# Altium schematic sheet ultrasonic_tank_monitor_battery.SchDoc
size A4; SheetNumber: 3; SheetTotal: 3
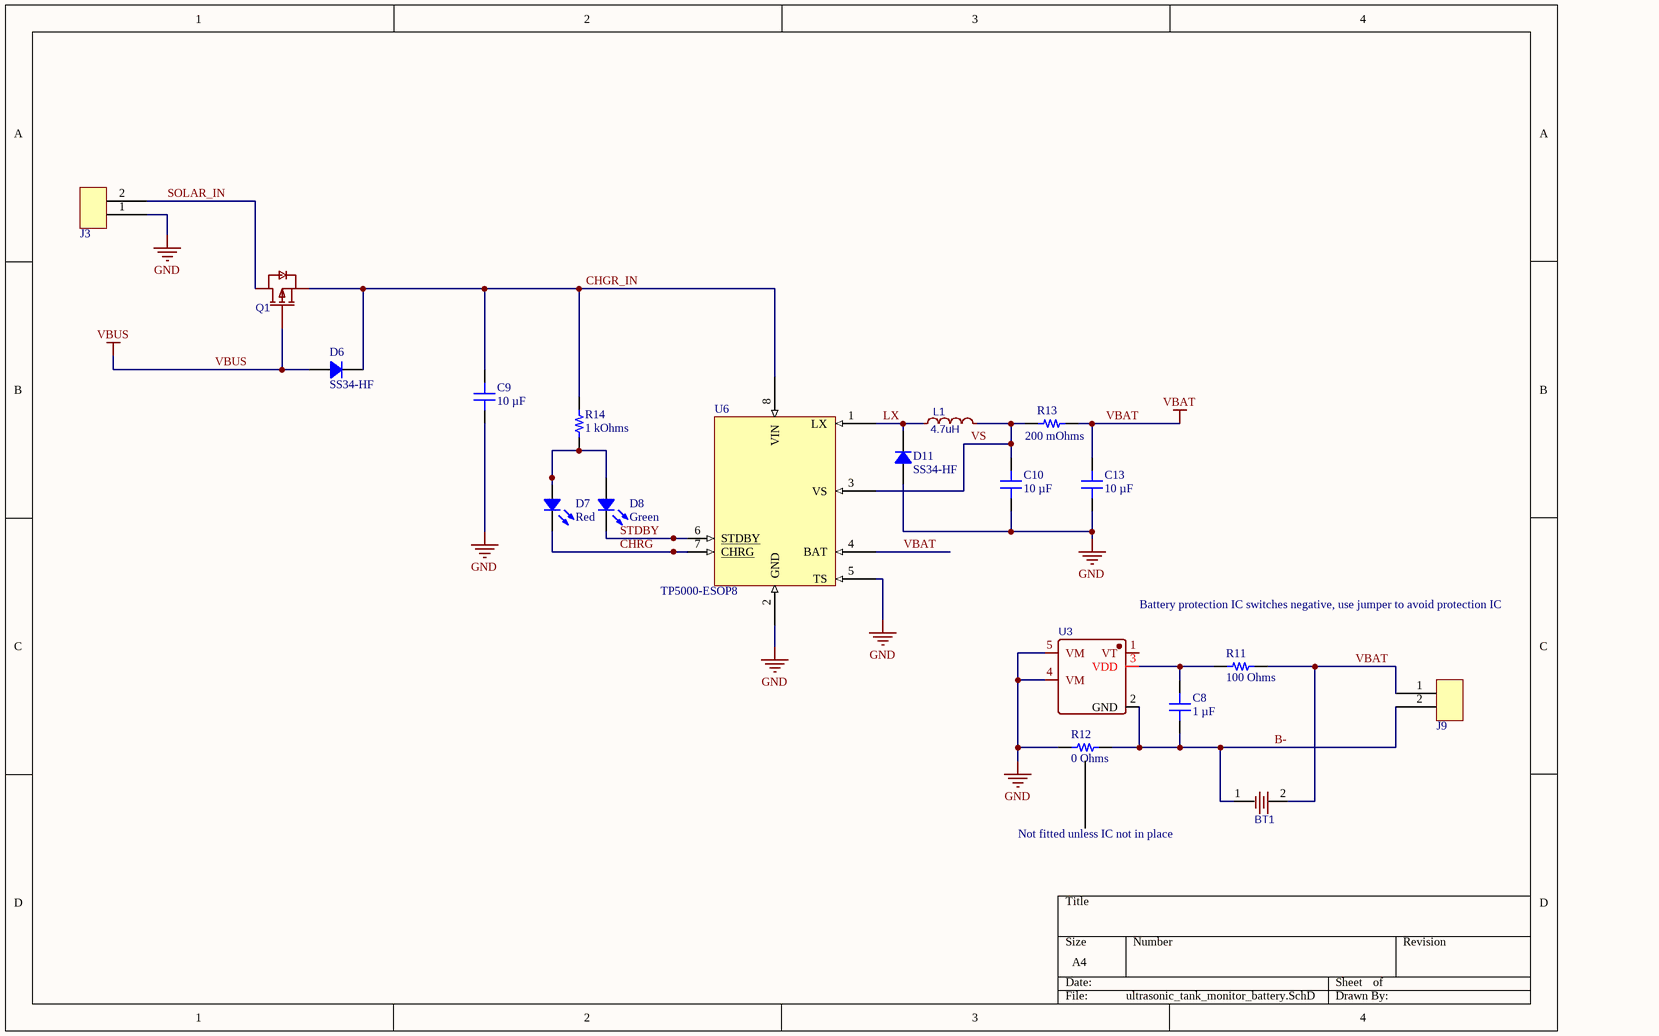
[diagram p0: ultrasonic_tank_monitor_battery.SchDoc]

## Parts
BT1  BH-18650-B1BA002  [BATTERY-SMD_18650-1S-L77.1-W20.7-1]  (value not drawn)
C8  1 µF  [CAP 0603_1608]
C9  10 µF  [CAP 0603_1608]
C10  10 µF  [CAP 0603_1608]
C13  10 µF  [CAP 0603_1608]
D6  SS34-HF  [DO214AC SMA]
D7  Red  [LED 0805_2012 RED]
D8  Green  [LED 0805_2012 GREEN]
D11  SS34-HF  [DO214AC SMA]
J3  B2B-PH-K-S  [CONN-TH_B2B-PH-K-S]  (value not drawn)
J9  S2B-PH-K-S  [CONN-TH_S2B-PH-K-S-LF-SN]  (value not drawn)
L1  4.7uH  [IND-SMD_L5.2-W5.2_YSPI0530]
Q1  SI2301-ZE  [SOT-23-3_L2.9-W1.3-P1.90-LS2.4-BR]  (value not drawn)
R11  100 Ohms  [RES 0603_1608]
R12  0 Ohms  [RES 1206_3216]
R13  200 mOhms  [RES 1206_3216]
R14  1 kOhms  [RES 0603_1608]
U3  SKCL3130ME  [SOT-23-5_L2.9-W1.6-P0.95-LS2.8-BR]  (value not drawn)
U6  TP5000-ESOP8  [ESOP-8_L4.9-W3.9-P1.27-LS6.0-BL-EP]

## Nets
GND: C9.1 C10.1 C13.1 D11.1 J3.1 R12.1 U3.4(VM) U3.5(VM) U6.2(GND) U6.5(TS)
VBAT: BT1.2 C13.2 J9.1 R11.2 R13.2 U6.4(BAT)
VBUS: D6.1 Q1.1(G)
B-: BT1.1 C8.2 J9.2 R12.2 U3.2(GND)
CHGR_IN: C9.2 D6.2 Q1.2(S) R14.1 U6.8(VIN)
CHRG: D7.2 U6.7(CHRG)
LX: D11.2 L1.1 U6.1(LX)
SOLAR_IN: J3.2 Q1.3(D)
STDBY: D8.2 U6.6(STDBY)
VS: C10.2 L1.2 R13.1 U6.3(VS)
NetC8_1: C8.1 R11.1 U3.3(VDD)
NetD7_1: D7.1 D8.1 R14.2

Not connected (* = marked no-connect by the designer): U3 1(VT)

## Notes on the sheet
- Battery protection IC switches negative, use jumper to avoid protection IC
- (near BT1) Not fitted unless IC not in place

## Library data of the parts
BT1 = 18650 SMD battery holder: Manufacturer: MYOUNG(美阳); Contributor: lcsc; Supplier: LCSC; Supplier Part: C2988620; Manufacturer Part: BH-18650-B1BA002; JLCPCB Part Class: Extended Part; spicePre: B; spiceSymbolName: BH-18650-B1BA002
C8 = LMK107B7105KAHT: CAP CER 1UF 10V X7R 0603; manufacturer: Taiyo Yuden; Tolerance: ±10%; Part Number: LMK107B7105KAHT; Value: 1 µF; Applications: Automotive; Capacitance: 1 µF; componentlink1description: Datasheet; componentlink1url: https://ds.yuden.co.jp/TYCOMPAS/ut/detail?pn=LMK107B7105KAHT  &u=M; componentlink2description: DigiKey Link; componentlink2url: https://www.digikey.com/en/products/detail/taiyo-yuden/LMK107B7105KAHT/4157759; Device Package: 0603 (1608 Metric); lastupdated: 3/06/2023 7:12:07 PM; Lifecycle Status: Active; Minimum Order: 1; Mounting Type: Surface Mount, MLCC; Operating Temperature: -55°C ~ 125°C; Package / Case: 0603 (1608 Metric); packaging: TapeAndReel; partid: 13032; Part Status: Active; price: 0.01; Ratings: AEC-Q200; series: M; Size / Dimension: 0.063" L x 0.031" W (1.60mm x 0.80mm); Supplier 1: DigiKey; Supplier Part Number 1: 587-3410-1-ND; Temperature Coefficient: X7R; Thickness (Max): 0.035" (0.90mm); Voltage - Rated: 10V
C9 C10 C13 = GRM188R61A106ME69D: CAP CER 10UF 10V X5R 0603; manufacturer: Murata Electronics; Tolerance: ±20%; Part Number: GRM188R61A106ME69D; Value: 10 µF; Applications: General Purpose; Capacitance: 10 µF; componentlink1description: Datasheet; componentlink1url: https://search.murata.co.jp/Ceramy/image/img/A01X/G101/ENG/GRM188R61A106ME69-01.pdf; componentlink2description: DigiKey Link; componentlink2url: https://www.digikey.com/en/products/detail/murata-electronics/GRM188R61A106ME69D/5027560; Device Package: 0603 (1608 Metric); lastupdated: 3/06/2023 7:12:12 PM; Lifecycle Status: Active; Minimum Order: 1; Mounting Type: Surface Mount, MLCC; Operating Temperature: -55°C ~ 85°C; Package / Case: 0603 (1608 Metric); packaging: TapeAndReel; partid: 11157; Part Status: Active; price: 0.01; series: GRM; Size / Dimension: 0.063" L x 0.031" W (1.60mm x 0.80mm); Supplier 1: DigiKey; Supplier Part Number 1: 490-10475-1-ND; Temperature Coefficient: X5R; Thickness (Max): 0.037" (0.95mm); Voltage - Rated: 10V
D6 D11 = SS34-HF: DIODE SCHOTTKY 40V 3A DO214AC; Manufacturer: Comchip Technology; Capacitance @ Vr, F: 450pF @ 4V, 1MHz; Current - Reverse Leakage @ Vr: 500 µA @ 40 V; Speed: Fast Recovery =< 500ns, > 200mA (Io); Voltage - Forward (Vf) (Max) @ If: 550 mV @ 3 A; Part Number: SS34-HF; ComponentLink1Description: Datasheet; ComponentLink1URL: http://www.comchiptech.com/admin/files/product/20190514101641.pdf; ComponentLink2Description: DigiKey Link; ComponentLink2URL: https://www.digikey.com/en/products/detail/comchip-technology/SS34-HF/10279693; Current - Average Rectified (Io): 3A; Diode Type: Schottky; LastUpdated: 7/08/2023 8:38:18 PM; Lifecycle Status: Active; Minimum Order: 1; Mounting Type: Surface Mount; Operating Temperature - Junction: -55°C ~ 125°C; Package / Case: DO-214AC, SMA; Packaging: TapeAndReel; PartId: 2138; Part Status: Active; Price: 0.07; Series: -; Supplier 1: DigiKey; Supplier Part Number 1: 641-2115-1-ND; Supplier Device Package: DO-214AC (SMA); Voltage - DC Reverse (Vr) (Max): 40 V
D7 = 5990110007F: LED RED 0805 SMD; Manufacturer: Dialight; Configuration: Standard; Current - Test: 20mA; Lens Color: 0.80mm; Lens Size: 1.40mm x 1.25mm; Lens Style: Rectangle with Flat Top; Millicandela Rating: 29mcd; Viewing Angle: 140°; Voltage - Forward (Vf) (Typ): 2.1V; Wavelength - Dominant: 633nm; Part Number: 5990110007F; Color: Red; ComponentLink1Description: Datasheet; ComponentLink1URL: http://www.dialightsignalsandcomponents.com/Assets/Brochures_And_Catalogs/Indication/CBI_SMD_new/Dialight_CBI_data_599-0805_Apr2018.pdf; ComponentLink2Description: DigiKey Link; ComponentLink2URL: https://www.digikey.com/en/products/detail/dialight/5990110007F/9385408; Device Package: 0805 (2012 Metric); Height (Max): 0.80mm; LastUpdated: 15/06/2023 8:27:56 PM; Lifecycle Status: Active; Minimum Order: 1; Mounting Type: Surface Mount; Package / Case: 0805 (2012 Metric); Packaging: TapeAndReel; PartId: 308; Part Status: Active; Price: 0.04; Series: 599; Size / Dimension: 2.00mm L x 1.25mm W; Supplier 1: DigiKey; Supplier Part Number 1: 350-4353-1-ND; Supplier Device Package: 0805; Value: Red
D8 = 5990181007F: LED GREEN 0805 SMD; Manufacturer: Dialight; Configuration: Standard; Current - Test: 20mA; Lens Color: 0.80mm; Lens Size: 1.40mm x 1.25mm; Lens Style: Rectangle with Flat Top; Millicandela Rating: 340mcd; Viewing Angle: 140°; Voltage - Forward (Vf) (Typ): 3.2V; Wavelength - Dominant: 525nm; Part Number: 5990181007F; Color: Green; ComponentLink1Description: Datasheet; ComponentLink1URL: http://www.dialightsignalsandcomponents.com/Assets/Brochures_And_Catalogs/Indication/CBI_SMD_new/Dialight_CBI_data_599-0805_Apr2018.pdf; ComponentLink2Description: DigiKey Link; ComponentLink2URL: https://www.digikey.com/en/products/detail/dialight/5990181007F/9385413; Device Package: 0805 (2012 Metric); Height (Max): 0.80mm; LastUpdated: 15/06/2023 8:28:13 PM; Lifecycle Status: Active; Minimum Order: 1; Mounting Type: Surface Mount; Package / Case: 0805 (2012 Metric); Packaging: TapeAndReel; PartId: 272; Part Status: Active; Price: 0.15; Series: 599; Size / Dimension: 2.00mm L x 1.25mm W; Supplier 1: DigiKey; Supplier Part Number 1: 350-4358-1-ND; Supplier Device Package: 0805; Value: Green
J3 = B2B-PH-K-S: 2 Pin JST PH 2.0 Connector Straight
J9 = S2B-PH-K-S: 2 Pin JST PH 2.0 Connector RA
L1 = 4.7uH 5.2x5.4 SMD 3.5A: 2.2uH 1.5A Power Inductor 3x3; Manufacturer: TAIYO YUDEN(太诱); Manufacturer Part: NR3015T2R2M; nameAlias: Value; Supplier: LCSC; Supplier Part: C86423; JLCPCB Part Class: Extended Part; spicePre: L; spiceSymbolName: NR3015T2R2M
Q1 = SI2301-ZE: P-CHAN Mosfet SI2301; Manufacturer: HXY MOSFET(华轩阳电子); Contributor: lcsc; Supplier: LCSC; Supplier Part: C5261052; Manufacturer Part: SI2301-ZE; JLCPCB Part Class: Extended Part; spicePre: U; spiceSymbolName: SI2301-ZE
R11 = WR06X101 JTL: RES 100 OHM 5% 1/10W 0603; Manufacturer: Walsin Technology Corporation; Power (Watts): 0.1W, 1/10W; Temperature Coefficient: ±100ppm/°C; Part Number: WR06X101 JTL; Value: 100 Ohms; ComponentLink1Description: Datasheet; ComponentLink1URL: https://www.passivecomponent.com/wp-content/uploads/chipR/ASC_WR.pdf; ComponentLink2Description: DigiKey Link; ComponentLink2URL: https://www.digikey.com/en/products/detail/walsin-technology-corporation/WR06X101-JTL/13241290; Composition: Thick Film; Device Package: 0603 (1608 Metric); Height - Seated (Max): 0.024" (0.60mm); LastUpdated: 17/09/2023 7:32:41 PM; Lifecycle Status: Active; Minimum Order: 1; Number of Terminations: 2; Operating Temperature: -55°C ~ 155°C; Package / Case: 0603 (1608 Metric); Packaging: CutTape; PartId: 62337; Part Status: Active; Price: 0.01; Resistance: 100 Ohms; Series: WR; Size / Dimension: 0.063" L x 0.031" W (1.60mm x 0.80mm); Supplier 1: DigiKey; Supplier Part Number 1: 1292-WR06X101JTLCT-ND; Supplier Device Package: 0603; Tolerance: ±5%
R12 = RCL06120000Z0EA: RES SMD 0 OHM 3/4W 1206 WIDE; Manufacturer: Vishay Dale; Power (Watts): 0.75W, 3/4W; Tolerance: Jumper; Part Number: RCL06120000Z0EA; ComponentLink1Description: Datasheet; ComponentLink1URL: http://www.vishay.com/docs/20046/rcle3.pdf; ComponentLink2Description: DigiKey Link; ComponentLink2URL: https://www.digikey.com/en/products/detail/vishay-dale/RCL06120000Z0EA/2587612; Composition: Thick Film; Device Package: 1206 (3216 Metric); Features: Automotive AEC-Q200; Height - Seated (Max): 0.026" (0.65mm); LastUpdated: 17/09/2023 7:43:47 PM; Lifecycle Status: Active; Minimum Order: 1; Number of Terminations: 2; Operating Temperature: -55°C ~ 155°C; Package / Case: 1206 (3216 Metric); Packaging: TapeAndReel; PartId: 66283; Part Status: Active; Price: 0.02; Ratings: AEC-Q200; Resistance: 0 Ohms; Series: RCL; Size / Dimension: 0.063" L x 0.126" W (1.60mm x 3.20mm); Supplier 1: DigiKey; Supplier Part Number 1: RCL0.0CCT-ND; Supplier Device Package: 0612; Value: 0 Ohms
R13 = PT1206FR-7W0R2L: RES 0.2 OHM 1% 1/2W 1206; Manufacturer: Yageo; Power (Watts): 0.5W, 1/2W; Temperature Coefficient: ±75ppm/°C; Part Number: PT1206FR-7W0R2L; ComponentLink1Description: Datasheet; ComponentLink1URL: https://www.yageo.com/upload/media/product/productsearch/datasheet/rchip/PYu-PT-Group_521_RoHS_L_2.pdf; ComponentLink2Description: DigiKey Link; ComponentLink2URL: https://www.digikey.com/en/products/detail/yageo/PT1206FR-7W0R2L/5915393; Composition: Thick Film; Device Package: 1206 (3216 Metric); Features: Automotive AEC-Q200, Current Sense, Moisture Resistant; Height - Seated (Max): 0.026" (0.65mm); LastUpdated: 15/10/2023 7:41:45 PM; Lifecycle Status: Active; Minimum Order: 1; Number of Terminations: 2; Operating Temperature: -55°C ~ 155°C; Package / Case: 1206 (3216 Metric); Packaging: TapeAndReel; PartId: 79151; Price: 0.06; Ratings: AEC-Q200; Resistance: 200 mOhms; Series: PT; Size / Dimension: 0.122" L x 0.063" W (3.10mm x 1.60mm); Supplier 1: DigiKey; Supplier Part Number 1: 13-PT1206FR-7W0R2LCT-ND; Supplier Device Package: 1206; Tolerance: ±1%; Value: 200 mOhms
R14 = SR0603JR-7T1KL: RES 1K OHM 5% 1/4W 0603; Manufacturer: Yageo; Power (Watts): 0.25W, 1/4W; Temperature Coefficient: ±100ppm/°C; Part Number: SR0603JR-7T1KL; Value: 1 kOhms; ComponentLink1Description: Datasheet; ComponentLink1URL: http://www.yageo.com/NewPortal/_en/search/productDocs.jsp?YageoPartNumber=SR0603JR-7T1KL; ComponentLink2Description: DigiKey Link; ComponentLink2URL: https://www.digikey.com/en/products/detail/yageo/SR0603JR-7T1KL/9696404; Composition: Thick Film; Device Package: 0603 (1608 Metric); Features: Automotive AEC-Q200, Pulse Withstanding; Height - Seated (Max): 0.022" (0.55mm); LastUpdated: 15/06/2023 7:42:39 PM; Lifecycle Status: Active; Minimum Order: 1; Number of Terminations: 2; Operating Temperature: -55°C ~ 155°C; Package / Case: 0603 (1608 Metric); Packaging: TapeAndReel; PartId: 23945; Part Status: Active; Price: 0.03; Ratings: AEC-Q200; Resistance: 1 kOhms; Series: SR; Size / Dimension: 0.063" L x 0.031" W (1.60mm x 0.80mm); Supplier 1: DigiKey; Supplier Part Number 1: YAG6166CT-ND; Supplier Device Package: 0603; Tolerance: ±5%
U3 = SKCL3130ME: 1 cell battery protection IC Li-ion OC OV UV SOT 23-5; Manufacturer: SHIKUES(时科); Contributor: LCSC; Supplier: LCSC; Supplier Part: C2941741; Manufacturer Part: SKCL3130ME; JLCPCB Part Class: Extended Part; spicePre: U; spiceSymbolName: SKCL3130ME
U6 = TP5000-ESOP8: 1 cell Li-ion / LIFEPO4 cell charger switchmode